# EAGLE design doogie_board (EAGLE 9.4.2)

## Sheet 1 of 4
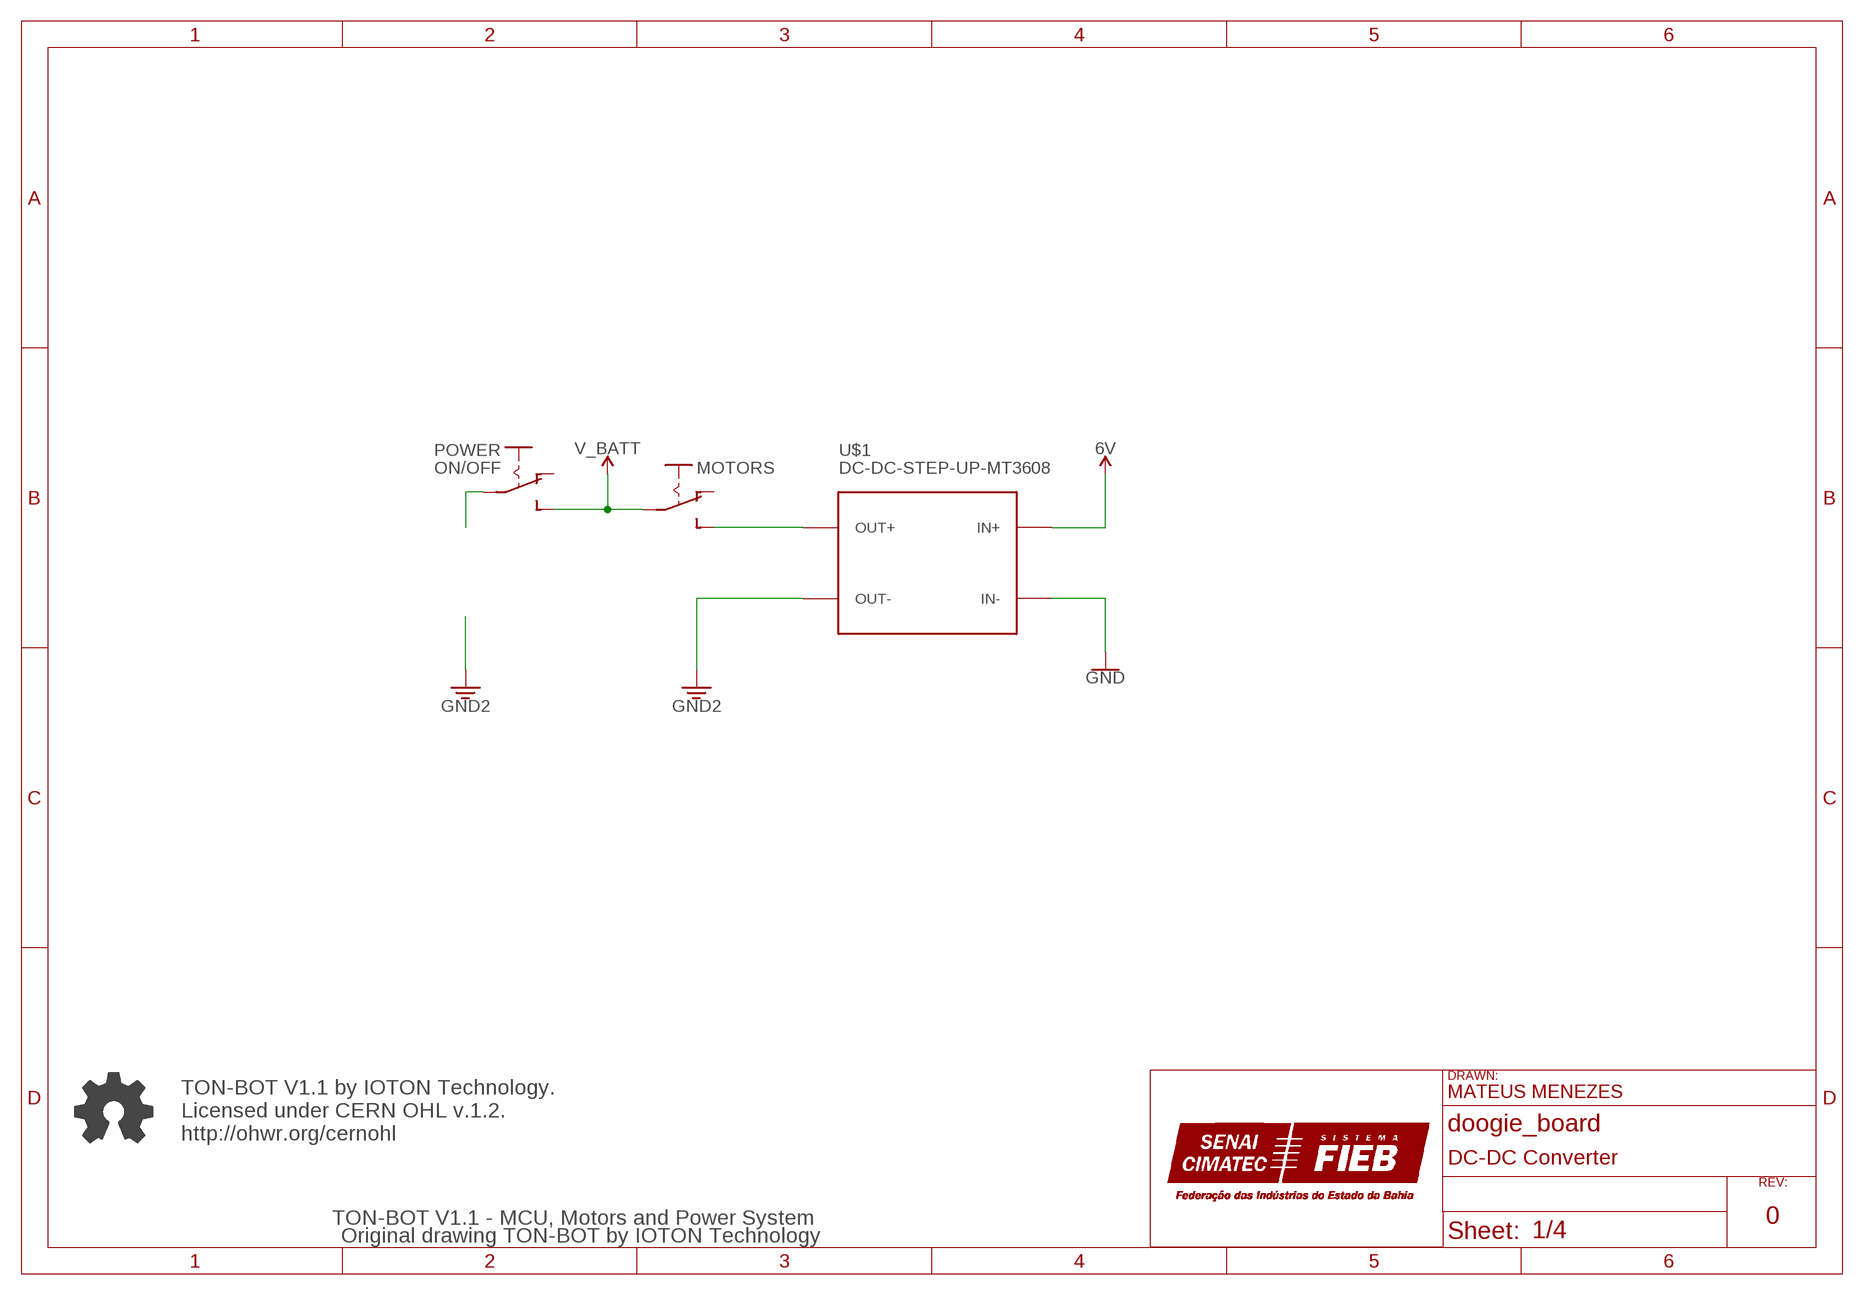
[diagram p0: schematic, sheet 1]

### Parts
MOTORS  SWITCHS  [SWITCH]
POWER  ON/OFF  SWITCHS  [SWITCH]
U$1  DC-DC-STEP-UP-MT3608  [DC-DC-STEP-UP-MT3608]
U$2  FRAME_A4P  [FRAME_A4P]

### Nets
3.3V: U$1.OUT- ; supply symbol labelled GND2 ; also sheet 3
GND: U$1.IN- ; also sheet 3
N$5: MOTORS.S U$1.OUT+
N$17: POWER.P
V_BATT: MOTORS.P POWER.S
VCC_1: U$1.IN+ ; supply symbol labelled 6V
Unconnected: MOTORS.O POWER.O

### Notes on the sheet
- TON-BOT V1.1 by IOTON Technology.
  Licensed under CERN OHL v.1.2.
  http://ohwr.org/cernohl
- TON-BOT V1.1 - MCU, Motors and Power System
- Original drawing TON-BOT by IOTON Technology

## Sheet 2 of 4
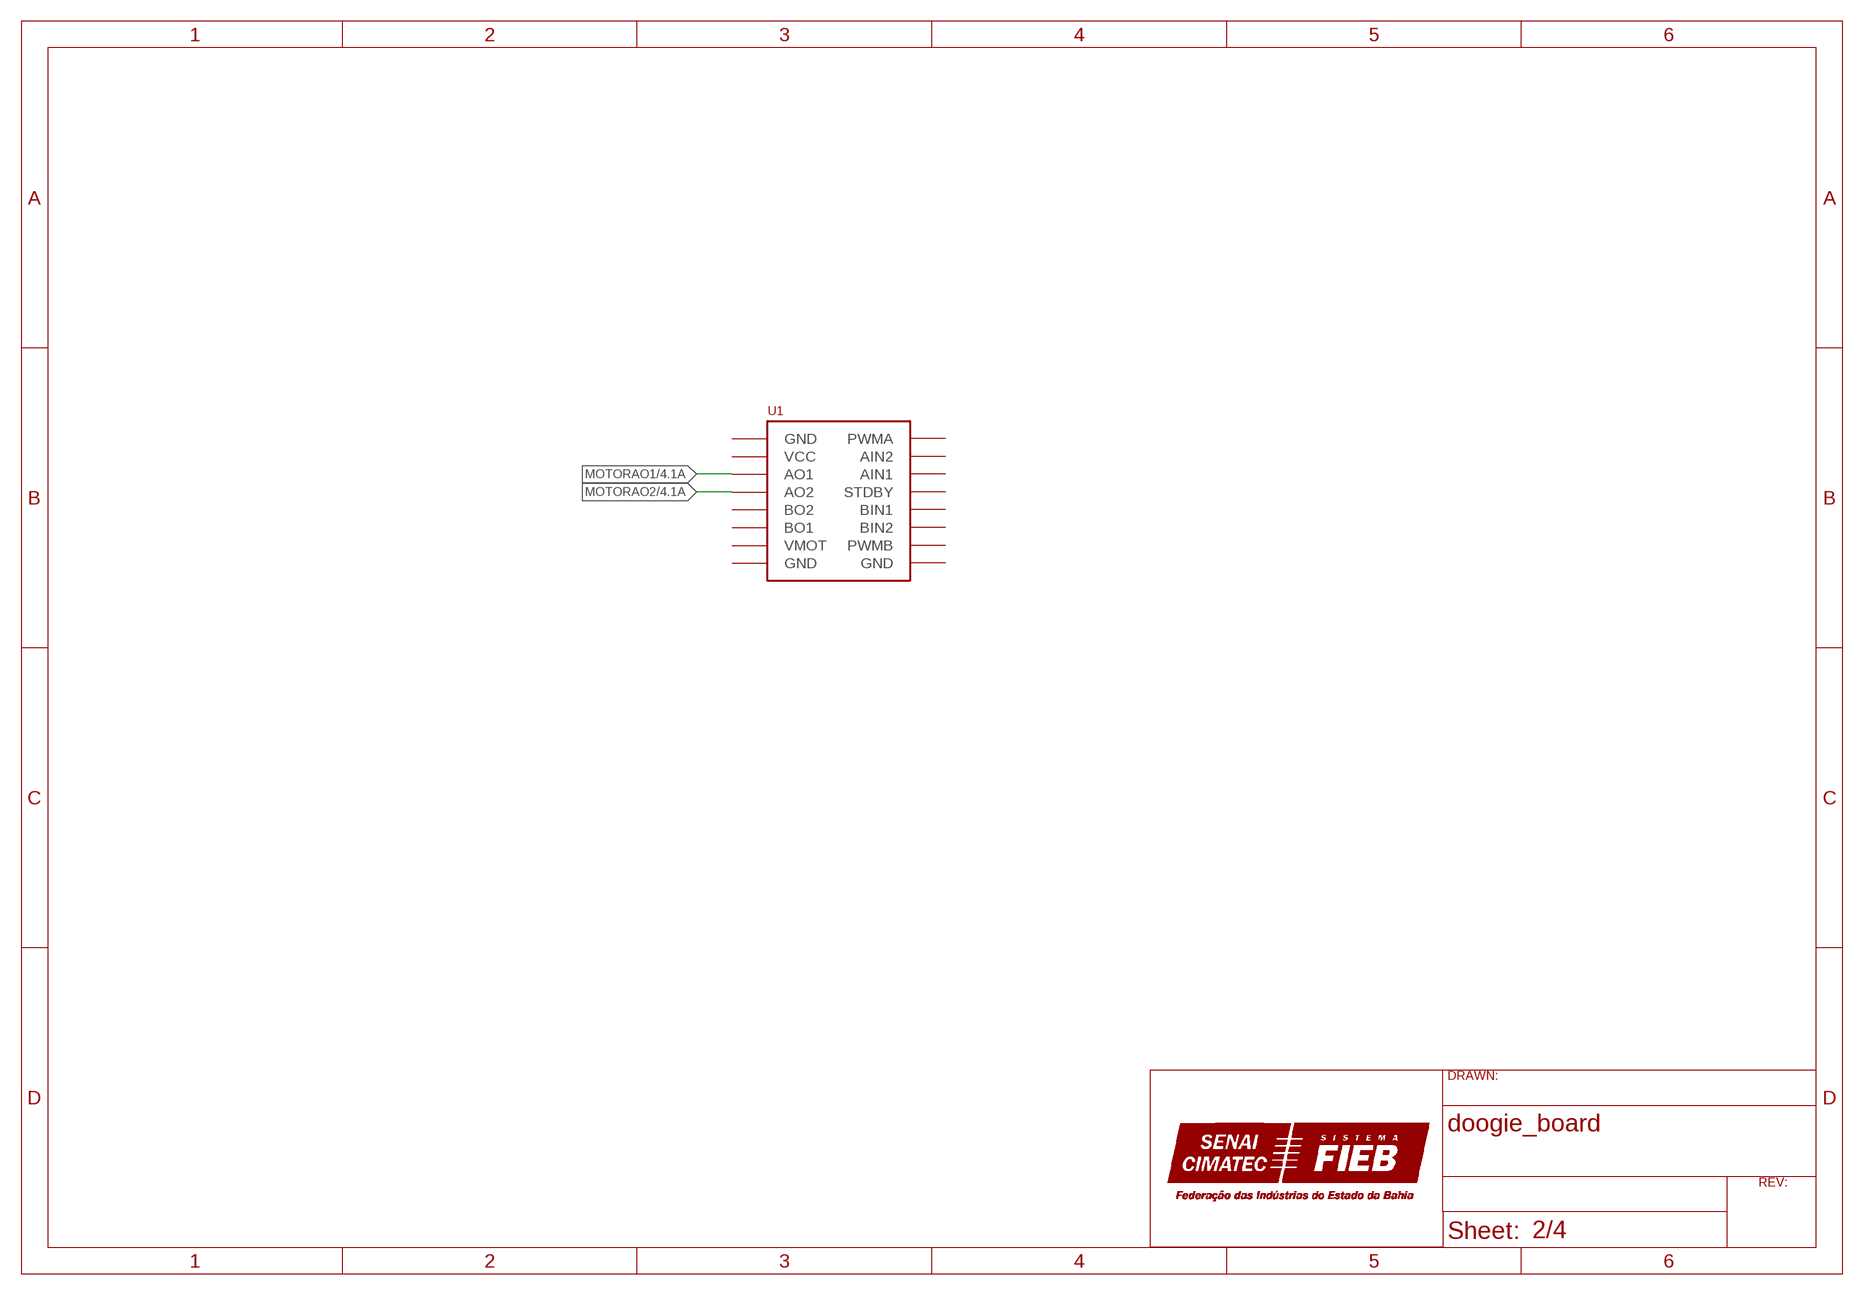
[diagram p1: schematic, sheet 2]

### Parts
U1  TB6612FNG  [TB6612FNG]
U$3  FRAME_A4P  [FRAME_A4P]

### Nets
MOTORAO1: U1.3(AO1) ; also sheet 4
MOTORAO2: U1.4(AO2) ; also sheet 4
Unconnected: U1.5(BO2) U1.6(BO1) U1.9(PWMA) U1.10(AIN2) U1.11(AIN1) U1.12(STDBY) U1.13(BIN1) U1.14(BIN2) U1.15(PWMB)

## Sheet 3 of 4
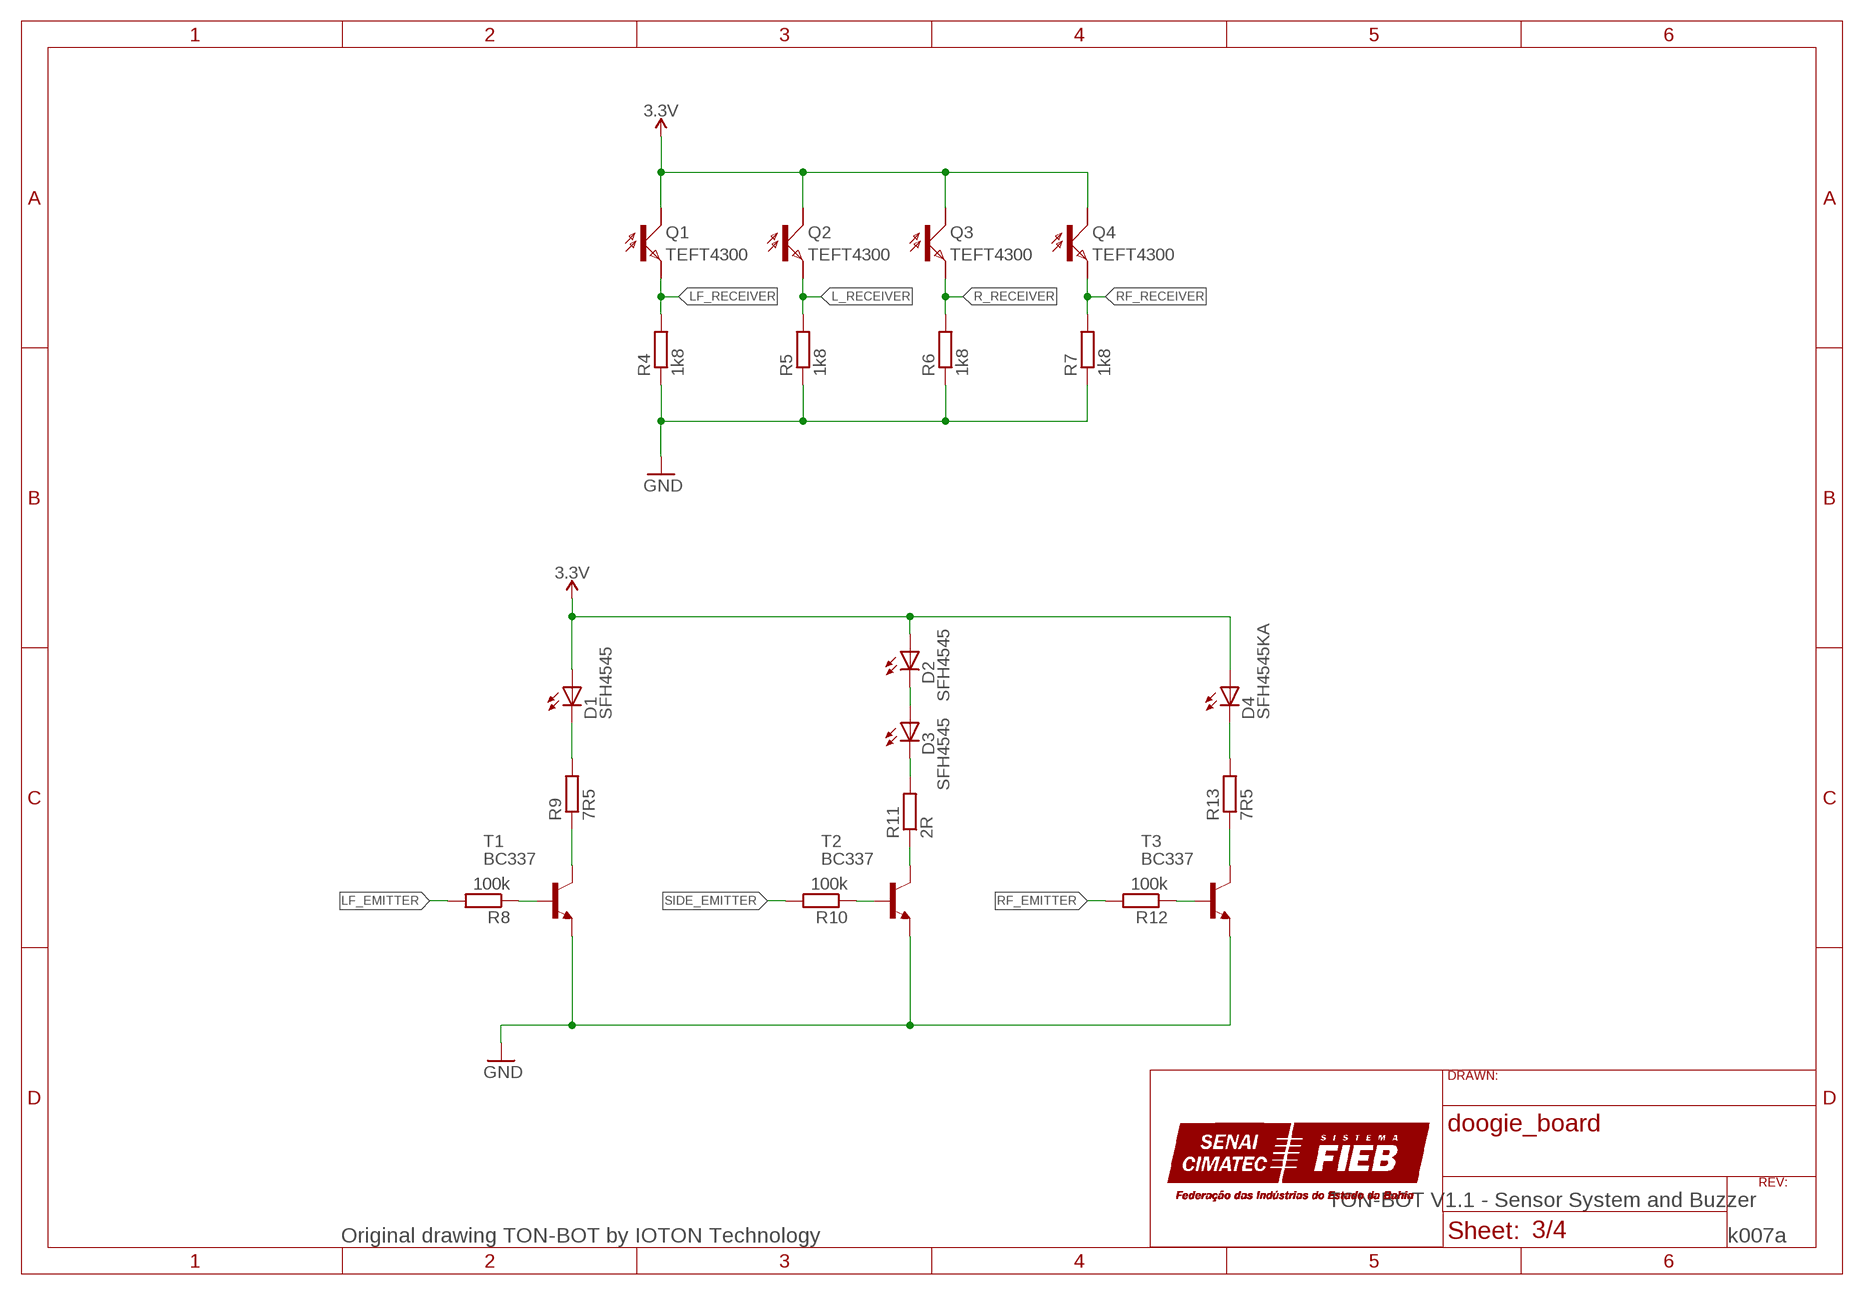
[diagram p2: schematic, sheet 3]

### Parts
D1  SFH4545  SFH4545AK  [SFH4545-AK]
D2  SFH4545  SFH4545KA  [SFH4545-KA]
D3  SFH4545  SFH4545KA  [SFH4545-KA]
D4  SFH4545KA  [SFH4545-KA]
Q1  TEFT4300  TEFT4300CE  [TEFT4300-CE]
Q2  TEFT4300  TEFT4300EC  [TEFT4300-EC]
Q3  TEFT4300  TEFT4300CE  [TEFT4300-CE]
Q4  TEFT4300  TEFT4300EC  [TEFT4300-EC]
R4  1k8  R-EU_0204/7  [0204/7]
R5  1k8  R-EU_0204/7  [0204/7]
R6  1k8  R-EU_0204/7  [0204/7]
R7  1k8  R-EU_0204/7  [0204/7]
R8  100k  R-EU_0204/7  [0204/7]
R9  7R5  R-EU_0204/7  [0204/7]
R10  100k  R-EU_0204/7  [0204/7]
R11  2R  R-EU_0204/7  [0204/7]
R12  100k  R-EU_0204/7  [0204/7]
R13  7R5  R-EU_0204/7  [0204/7]
T1  BC337  [TO92]
T2  BC337  [TO92]
T3  BC337  [TO92]
U$4  FRAME_A4P  [FRAME_A4P]

### Nets
3.3V: D1.A D2.A D4.A Q1.C Q2.C Q3.C Q4.C ; also sheet 1
GND: R4.1 R5.1 R6.1 R7.1 T1.1(E) T2.1(E) T3.1(E) ; also sheet 1
L_RECEIVER: Q2.E R5.2
LF_EMITTER: R8.2
LF_RECEIVER: Q1.E R4.2
N$1: R9.1 T1.3(C)
N$2: R11.1 T2.3(C)
N$3: R13.1 T3.3(C)
N$4: R8.1 T1.2(B)
N$6: R10.1 T2.2(B)
N$7: R12.1 T3.2(B)
N$14: D2.K D3.A
N$15: D1.K R9.2
N$16: D4.K R13.2
N$20: D3.K R11.2
R_RECEIVER: Q3.E R6.2
RF_EMITTER: R12.2
RF_RECEIVER: Q4.E R7.2
SIDE_EMITTER: R10.2

### Notes on the sheet
- TON-BOT V1.1 - Sensor System and Buzzer
- Original drawing TON-BOT by IOTON Technology | k007a

## Sheet 4 of 4
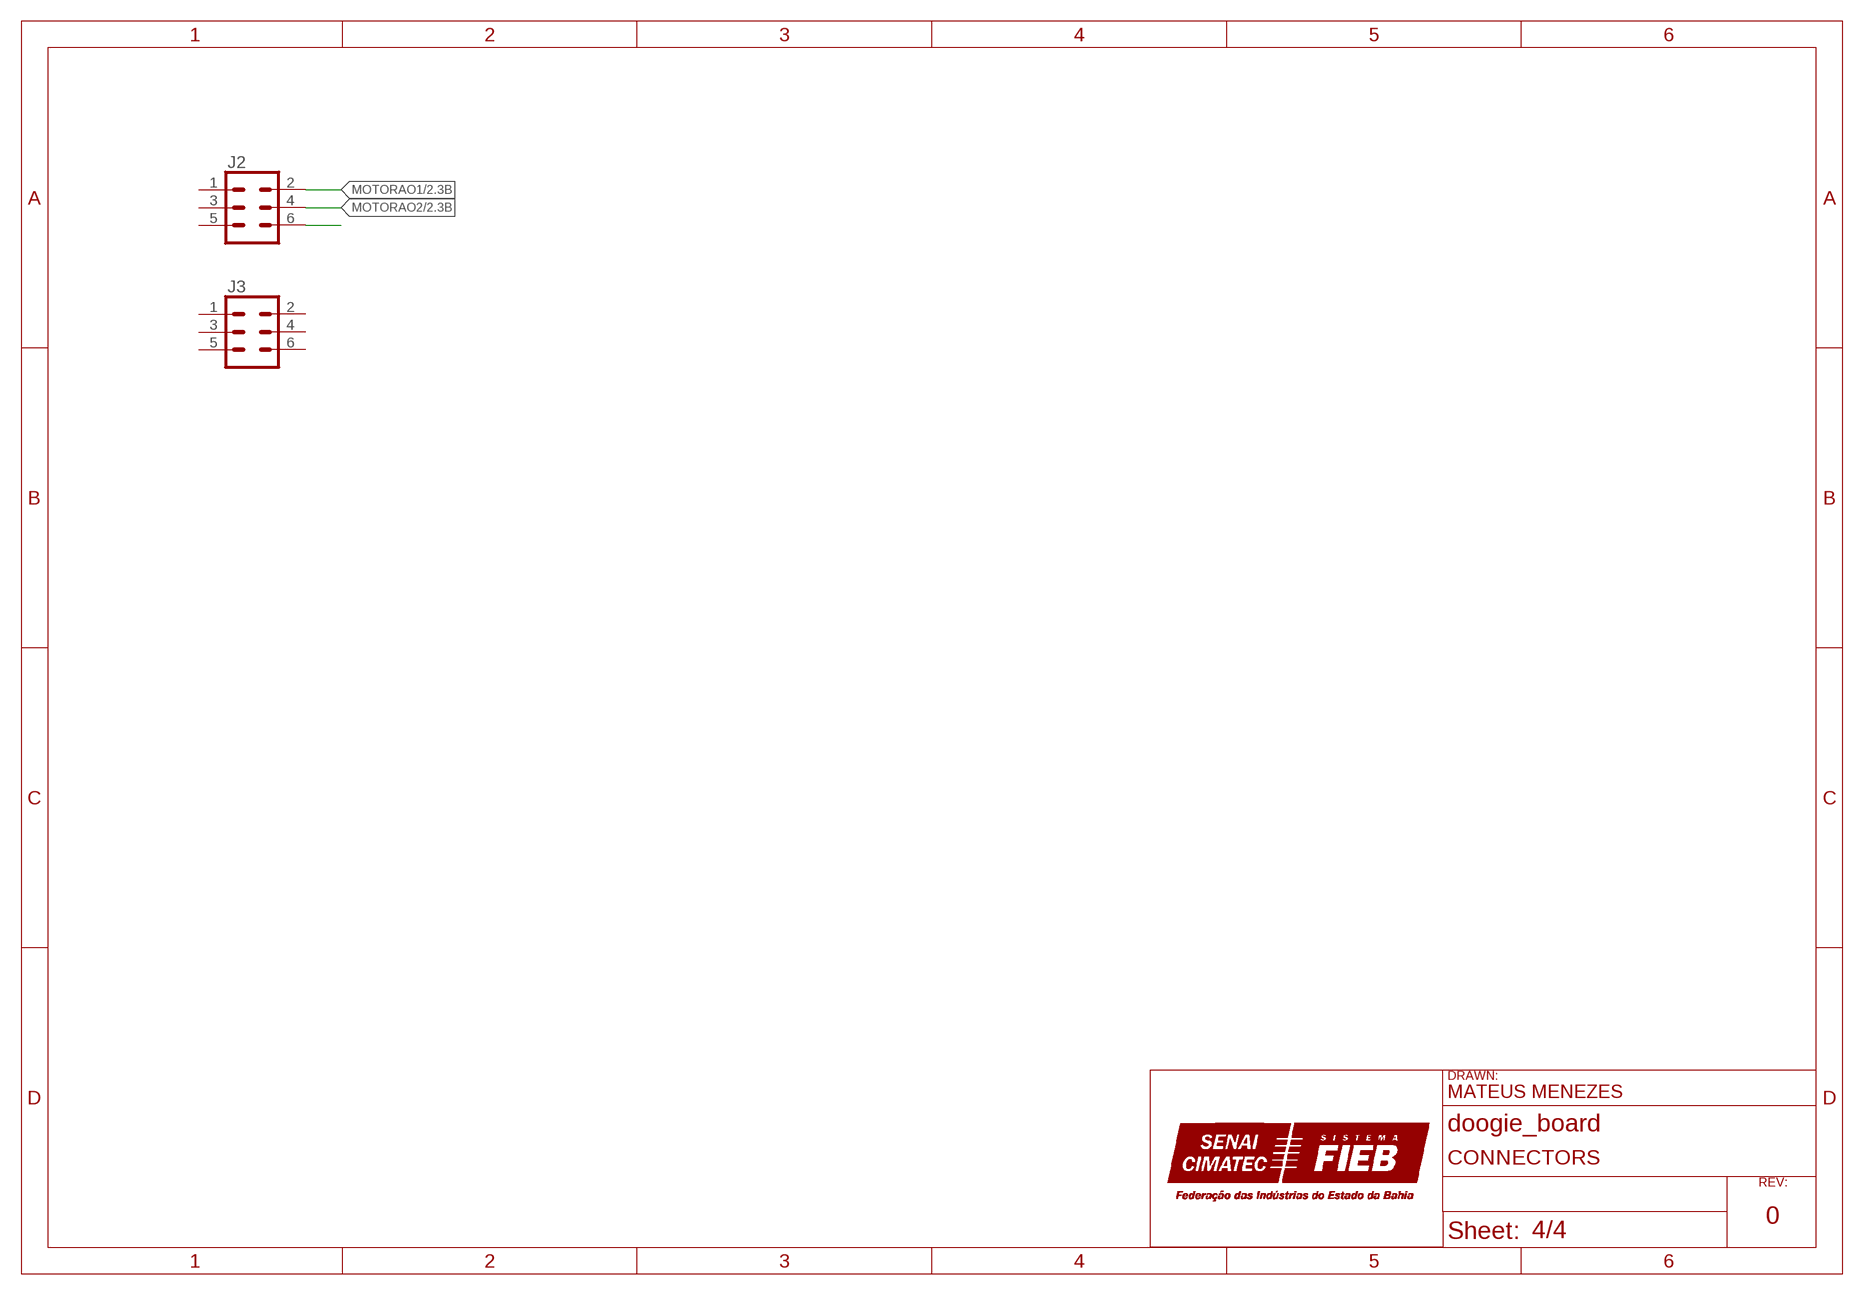
[diagram p3: schematic, sheet 4]

### Parts
J2  CONN_03X2SHROUD  [2X3-SHROUDED]
J3  CONN_03X2SHROUD  [2X3-SHROUDED]
U$5  FRAME_A4P  [FRAME_A4P]

### Nets
MOTORAO1: J2.2 ; also sheet 2
MOTORAO2: J2.4 ; also sheet 2
N$10: J2.6
Unconnected: J2.1 J2.3 J2.5 J3.1 J3.2 J3.3 J3.4 J3.5 J3.6

## Power pins joined to a net without a drawn wire
GND: U1.1(GND) U1.8(GND) U1.16(GND)
VCC: U1.2(VCC)
VMOT: U1.7(VMOT)

## Library data of the parts
D1-D4 = maze:SFH4545
J2 J3 = SparkFun-Connectors:CONN_03X2: Multi connection point. Often used as Generic Header-pin footprint for 0.1 inch spaced/style header connections You can populate with any combo of single row headers, but if you'd like an exact match, check these: Header - 2x3 (Male, 0.1") <https://www.sparkfun.com/products/12807> (PRT-12807) Header - 2x3 (Female, 0.1") <https://www.sparkfun.com/products/13010> (PRT-13010) 2x3 Pin Shrouded Header <https://www.sparkfun.com/products/10877> (PRT-10877) On any of the 0.1 inch spaced packages, you can populate with these: Break Away Headers - Straight <https://www.sparkfun.com/products/116> (PRT-00116) Break Away Male Headers - Right Angle <https://www.sparkfun.com/products/553> (PRT-00553) Female Headers <https://www.sparkfun.com/products/115> (PRT-00115) Break Away Headers - Machine Pin <https://www.sparkfun.com/products/117> (PRT-00117) Break Away Female Headers - Swiss Machine Pin <https://www.sparkfun.com/products/743> (PRT-00743) Special note: the shrouded connector mates well with our 3x2 ribbon cables: Ribbon Crimp Connector - 6-pin (2x3, Female) <https://www.sparkfun.com/products/10651> (PRT-10651) Ribbon Cable - 6 wire (15ft) <https://www.sparkfun.com/products/10646> (PRT-10646); PROD_ID: CONN-10681; SF_ID: PRT_10877
MOTORS POWER = pololu:SWITCH: SLIDING SWITCH 0.1" spacing through hole, vertical SPDT slide switch http://www.ladyada.net/library/pcb/eaglelibrary.html
Q1-Q4 = maze:TEFT4300
R4-R13 = rcl:R-EU_: RESISTOR, European symbol; SPICEPREFIX: R
T1-T3 = transistor:BC337: NPN TRANSISTOR
U1 = doogie:TB6612FNG: TB6612FNG Dual Motor Driver Carrier This tiny board is an easy way to use Toshiba’s TB6612FNG dual motor driver, which can independently control two bidirectional DC motors or one bipolar stepper motor. A recommended motor voltage of 4.5 V to 13.5 V and peak current output of 3 A per channel (1 A continuous) make this a great motor driver for low-power motors.
U$1 = diy-modules:DC-DC-STEP-UP-MT3608: DC/DC Step-Up Regulator based on MT3608 chip MT3608 datasheet available here: https://www.olimex.com/Products/Breadboarding/BB-PWR-3608/resources/MT3608.pdf Click here to find device on ebay.com <http://www.ebay.com/sch/mt3608+module>
U$2 = doogie:FRAME_A4P: BIR Frame A4 landscape; DESIGNER_NAME: MATEUS MENEZES; PAGE_DESCRIPTION: DC-DC Converter; REV_NUMBER: 0
U$3 U$4 = doogie:FRAME_A4P: BIR Frame A4 landscape
U$5 = doogie:FRAME_A4P: BIR Frame A4 landscape; DESIGNER_NAME: MATEUS MENEZES; PAGE_DESCRIPTION: CONNECTORS; REV_NUMBER: 0

## Board
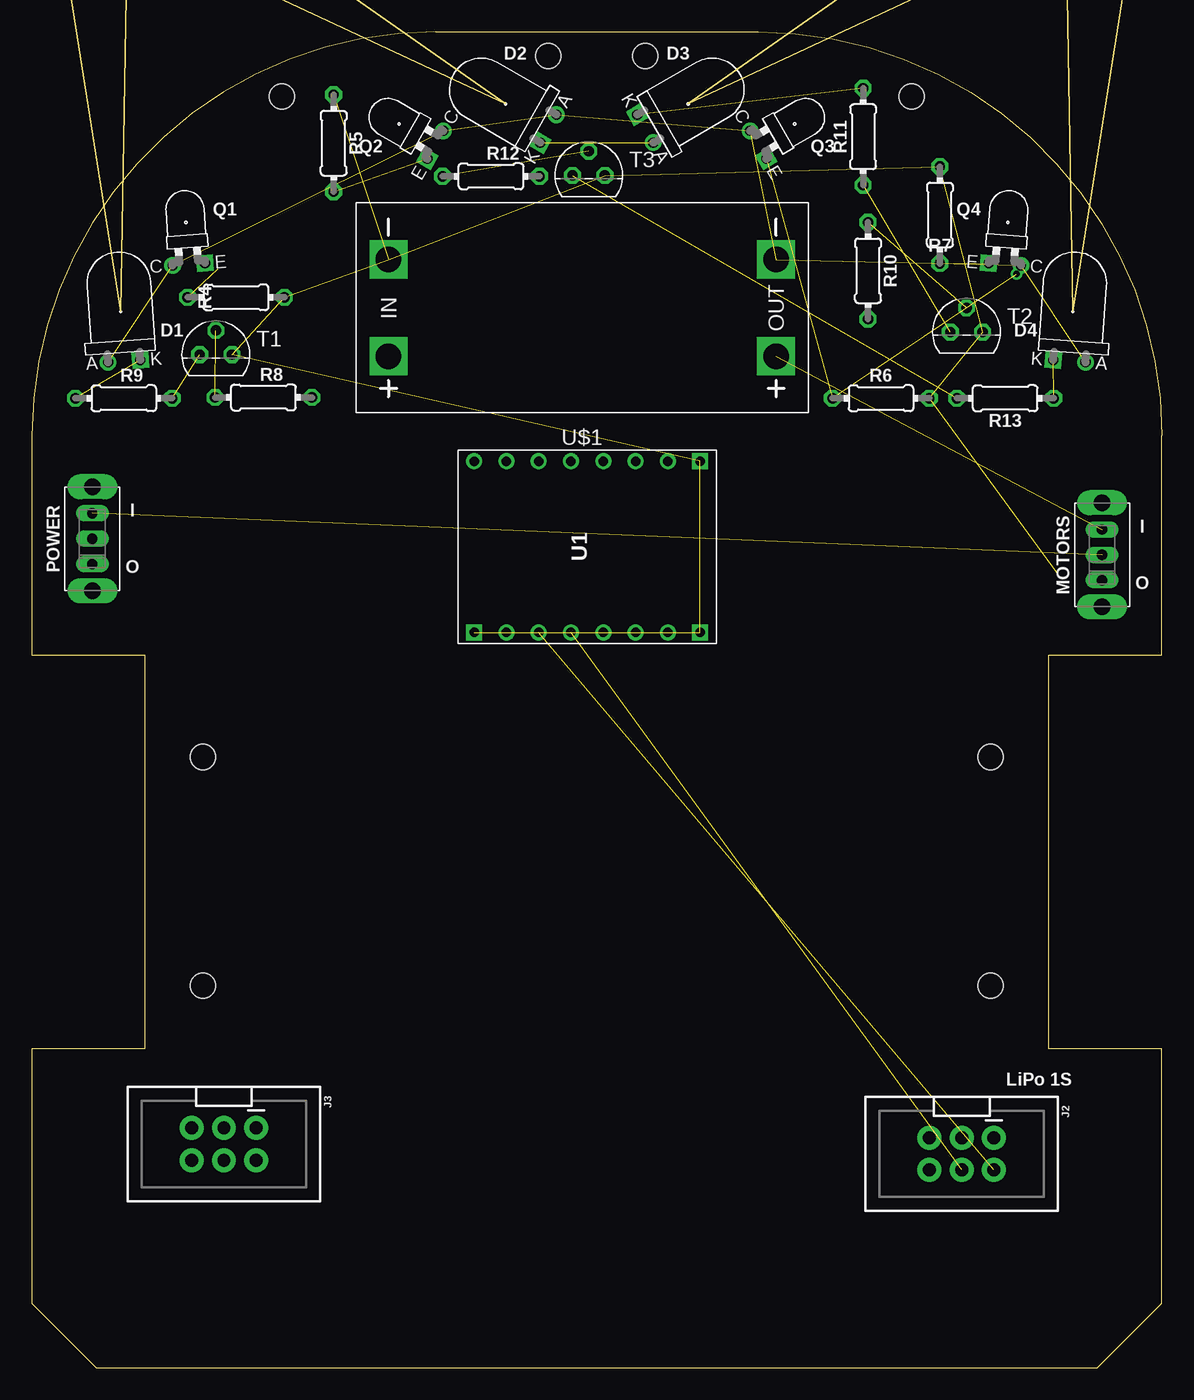
[diagram p4: board, top side]
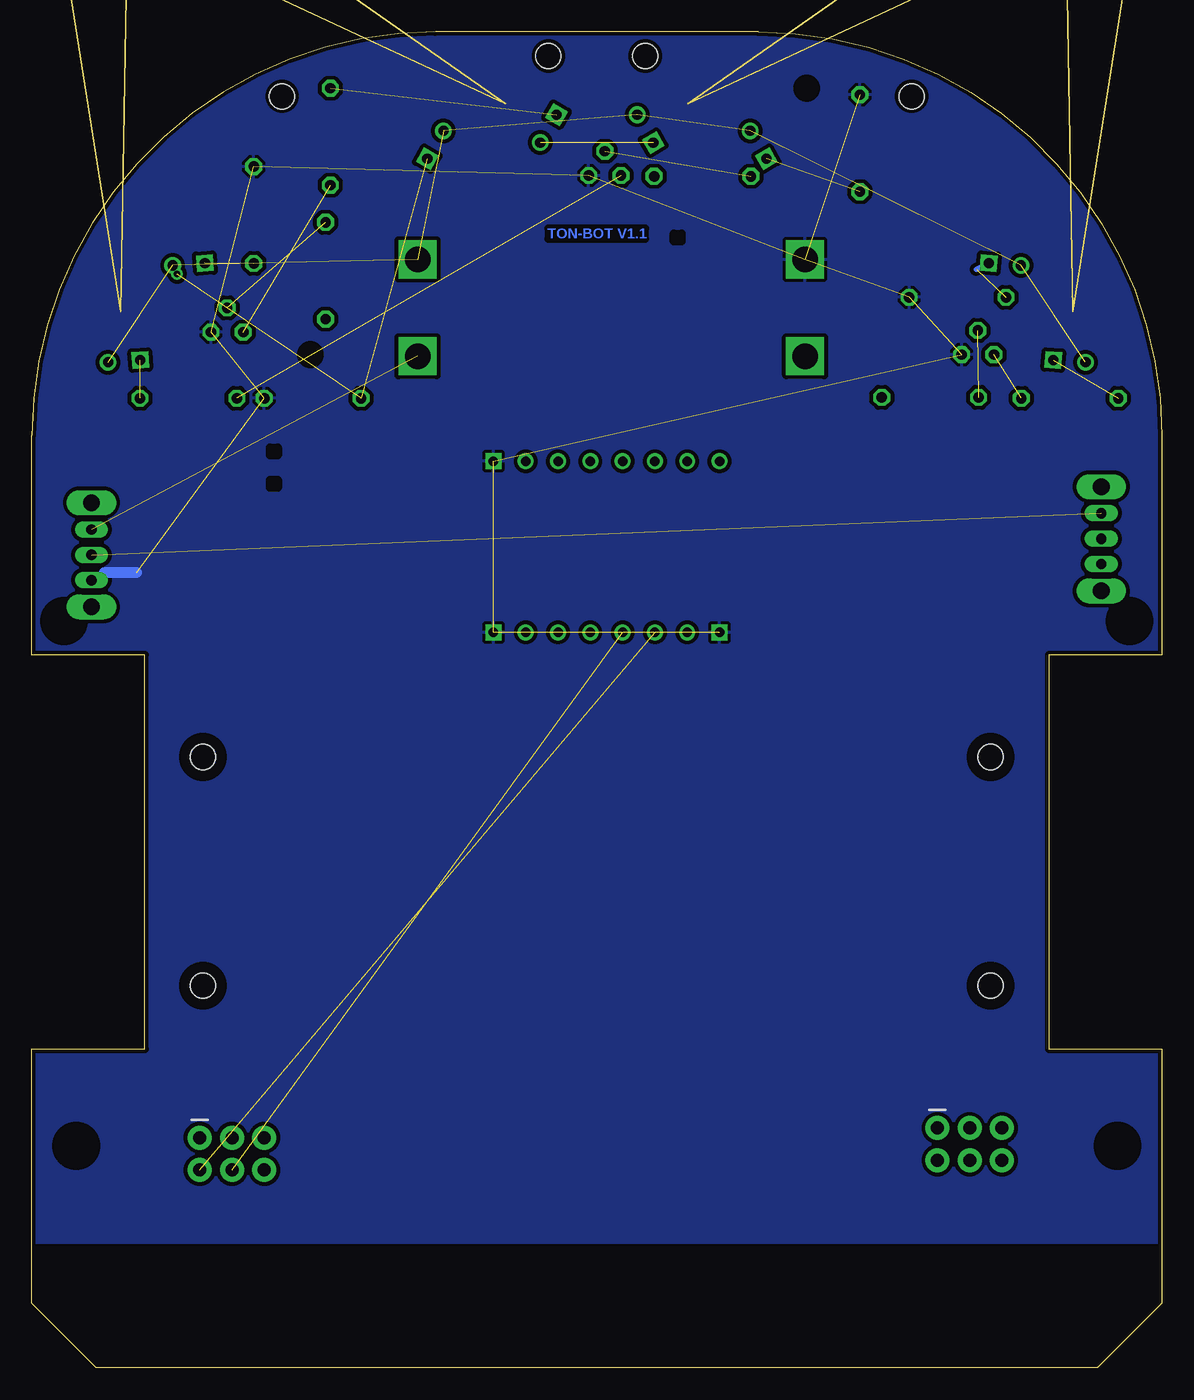
[diagram p5: board, bottom side, seen from below]

Size 88.9 x 105.09 mm. Coordinates in mm from the lower left corner, seen from the top.
Outline: 0,25.08 0,5.08 5.08,0 83.82,0 88.9,5.08 88.9,25.08 80.01,25.08 80.01,56.08 88.9,56.08 88.9,73.34 arc90 57.15,105.09 31.75,105.09 arc90 0,73.34 0,56.08 8.89,56.08 8.89,25.08 0,25.08
Copper layers (1*16): Top 0.035mm / dielectric 1.5mm / Bottom 0.035mm
Design rules "default": minimum track width 8mil, minimum drill 19mil, track to track 8mil, track to pad 8mil, pad to pad 8mil, via to via 8mil, smd to smd 8mil, copper to edge 10mil, drill to drill 8mil, minimum pad ring 10mil, minimum via ring 8mil, stop-mask expansion 4mil, vias tented up to drill 20mil, thermal gap 10mil
Holes 2 mm at 13.47,48.05 13.47,30.05 75.43,30.05 75.43,48.05 48.26,103.19 40.64,103.19 19.69,100.01 69.22,100.01
tRestrict: area 23.1,38.3 to 24.6,39.8; area 66.2,68.8 to 67.7,70.3
bRestrict: area 1.1,57.3 to 4,60.2; area 84.9,57.3 to 87.8,60.2; area 2.1,16 to 4.9,18.9; area 84,16 to 86.8,18.9; area 12,28.6 to 14.9,31.5; area 12,46.6 to 14.9,49.5; area 74,46.6 to 76.9,49.5; area 74,28.6 to 76.9,31.5; area 69.5,71.8 to 70.2,72.4; area 69.5,69.2 to 70.2,69.8; area 37.8,88.6 to 38.4,89.2; area 27.2,99.9 to 28.7,101.4; area 66.2,78.9 to 67.7,80.4

### Footprints (pad centres in the part's own frame; a part is rotated, then mirrored left to right if it is on the bottom)
SFH4545-AK = drill 0.8: A -1.27,0 | drill 0.8 square: K 1.27,0
SFH4545-KA = drill 0.8: A 1.27,0 | drill 0.8 square: K -1.27,0
2X3-SHROUDED = drill 1.016 pad 1.88: 1 -1.27,2.54; 2 1.27,2.54; 3 -1.27,0; 4 1.27,0; 5 -1.27,-2.54; 6 1.27,-2.54
SWITCH = drill 0.8 pad 1.27 long: O -2,0; P 0,0; S 2,0 | drill 1.3 long: P$1 -4.1,0; P$2 4.1,0
TEFT4300-CE = drill 0.8: C -1.27,0 | drill 0.8 square: E 1.27,0
TEFT4300-EC = drill 0.8: C 1.27,0 | drill 0.8 square: E -1.27,0
0204/7 = drill 0.813 octagon: 1 -3.81,0; 2 3.81,0
TO92 = drill 0.813 octagon: 1 1.27,0; 2 0,1.905; 3 -1.27,0
TB6612FNG = drill 0.75 square: 1 -6.731,8.89; 8 -6.731,-8.89; 16 6.731,-8.89 | drill 0.75: 2 -6.731,6.35; 3 -6.731,3.81; 4 -6.731,1.27; 5 -6.731,-1.27; 6 -6.731,-3.81; 7 -6.731,-6.35; 9 6.731,8.89; 10 6.731,6.35; 11 6.731,3.81; 12 6.731,1.27; 13 6.731,-1.27; 14 6.731,-3.81; 15 6.731,-6.35
DC-DC-STEP-UP-MT3608 = drill 2 pad 2.8 square: IN+ 15.24,3.81; IN- 15.24,-3.81; OUT+ -15.24,3.81; OUT- -15.24,-3.81

### Placement (x,y rotation side)
D1  7.27,79.18 4 top
D2  40.64,97.47 60 top
D3  48.26,97.47 300 top
D4  81.63,79.18 356 top
J2  73.15,16.82 270 top
J3  15.11,17.59 270 top
MOTORS  84.2,63.94 90 top
POWER  4.76,65.21 90 top
Q1  12.35,86.8 4 top
Q2  31.75,96.2 60 top
Q3  57.15,96.2 300 top
Q4  76.55,86.8 356 top
R4  16.07,84.2 180 top
R5  23.75,96.33 270 top
R6  66.8,76.26 180 top
R7  71.44,90.68 270 top
R8  18.22,76.32 0 top
R9  7.24,76.26 180 top
R10  65.79,86.29 270 top
R11  65.41,96.83 90 top
R12  36.13,93.72 0 top
R13  76.58,76.26 0 top
T1  14.48,79.69 0 top
T2  73.53,81.47 0 top
T3  43.82,93.79 0 top
U1  43.69,64.58 90 top
U$1  43.31,83.37 180 top
U$2  -30.1,78.17 0 top  (outside the outline)
U$3  -31.11,77.15 0 top  (outside the outline)
U$4  -32.13,76.13 0 top  (outside the outline)
U$5  -202.06,1.08 0 top  (outside the outline)

### Tracks (layer width: path | path; a pad name or v marks a point on that pad's centre or on a via)
3.3V  (7 unrouted)
GND  (11 unrouted)
  Bottom 0.813: 80.65,62.55 83.19,62.55
  pour Bottom (isolate 0.305, rank 3): 0,105.09 0,9.84 88.9,9.84 88.9,105.09
L_RECEIVER  (1 unrouted)
LF_RECEIVER  (1 unrouted)
  Bottom 0.406: 14.61,86.41 Q1.E
MOTORAO1  (1 unrouted)
MOTORAO2  (1 unrouted)
N$1  (1 unrouted)
N$2  (1 unrouted)
N$3  (1 unrouted)
N$4  (1 unrouted)
N$5  (1 unrouted)
N$6  (1 unrouted)
N$7  (1 unrouted)
N$14  (1 unrouted)
N$15  (1 unrouted)
N$16  (1 unrouted)
N$20  (1 unrouted)
R_RECEIVER  (via drill 0.5)  (2 unrouted)
  other vias: 77.47,86.04
RF_RECEIVER  (1 unrouted)
V_BATT  (1 unrouted)

### Text on the board
Bottom: TON-BOT V1.1
tPlace: I | I | O | O | LiPo 1S
tDocu: TON-BOT V1.1 by IOTON Technology. / Licensed under CERN OHL v.1.2. / http://ohwr.org/cernohl